# EAGLE schematic EEZ DIB DCP505 r1B2 (EAGLE 7.2.0)
Assembly variants: Farnell, TME

## Sheet 1 of 6
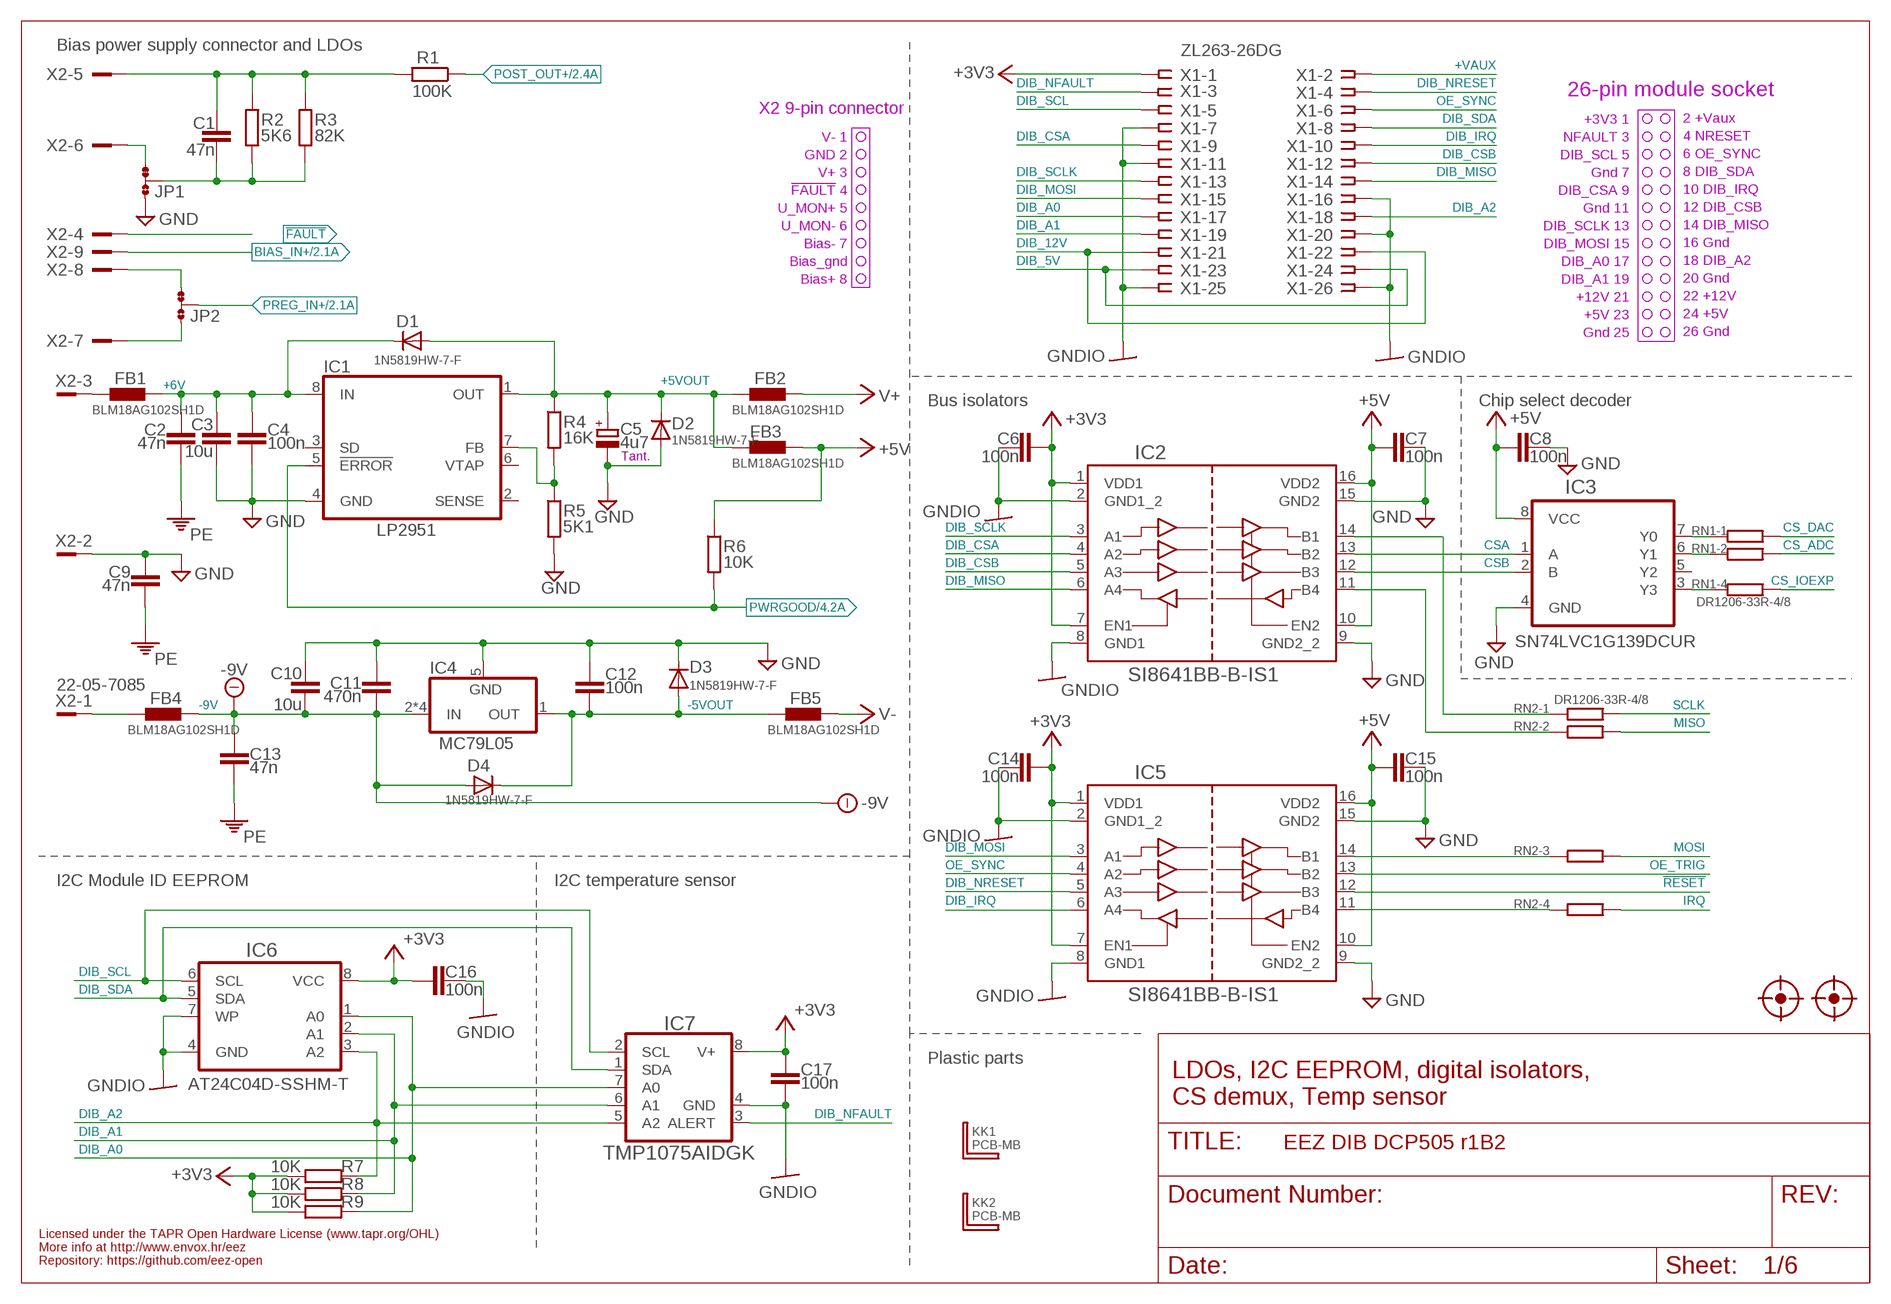
[diagram p0: schematic, sheet 1]

### Parts
C1  47n  C-EUC0805  [C0805]
C2  47n  C-EUC1206  [C1206]
C3  10u  C-EUC1206  [C1206]
C4  100n  C-EUC0603  [C0603]
C5  4u7  ECAP1206  [EC1206]
C6  100n  C-EUC0603  [C0603]
C7  100n  C-EUC0603  [C0603]
C8  100n  C-EUC0603  [C0603]
C9  47n  C-EUC1206  [C1206]
C10  10u  C-EUC1206  [C1206]
C11  470n  C-EUC0805  [C0805]
C12  100n  C-EUC0603  [C0603]
C13  47n  C-EUC1206  [C1206]
C14  100n  C-EUC0603  [C0603]
C15  100n  C-EUC0603  [C0603]
C16  100n  C-EUC0603  [C0603]
C17  100n  C-EUC0603  [C0603]
D1  1N5819HW-7-F  DIODE-SOD323-W  [SOD323-W]
D2  1N5819HW-7-F  DIODE-SOD323-W  [SOD323-W]
D3  1N5819HW-7-F  DIODE-SOD323-W  [SOD323-W]
D4  1N5819HW-7-F  DIODE-SOD323-W  [SOD323-W]
FB1  BLM18AG102SH1D  FERRITE_BEAD0603  [BEAD0603]
FB2  BLM18AG102SH1D  FERRITE_BEAD0603  [BEAD0603]
FB3  BLM18AG102SH1D  FERRITE_BEAD0603  [BEAD0603]
FB4  BLM18AG102SH1D  FERRITE_BEAD0603  [BEAD0603]
FB5  BLM18AG102SH1D  FERRITE_BEAD0603  [BEAD0603]
FM1  FIDUCIAL_2  [FIDUCIAL_DUAL]
FM2  FIDUCIAL_2  [FIDUCIAL_DUAL]
IC1  LP2951  LP2951SO8  [SOIC127P600X175-8N]
IC2  SI8641BB-B-IS1  SI8641NSOIC-16  [SOIC-16]
IC3  SN74LVC1G139DCUR  SN74LVC1G139-VSSOP  [DCU8]
IC4  MC79L05  MC79LXXSOIC  [SOIC127P600X173-8N]
IC5  SI8641BB-B-IS1  SI8641NSOIC-16  [SOIC-16]
IC6  AT24C04D-SSHM-T  AT24CXXSOIC8  [SOIC127P600X173-8N]
IC7  TMP1075AIDGK  TMPX75DGK  [DGK8]
JP1  JP3-CUT  [JP3-CUT]
JP2  JP3-CUT  [JP3-CUT]
KK1  PCB-MB  [PCB-MB]
KK2  PCB-MB  [PCB-MB]
R1  100K  R-EU_R0805  [R0805]
R2  5K6  R-EU_R0805  [R0805]
R3  82K  R-EU_R0805  [R0805]
R4  16K  R-EU_R0805  [R0805]
R5  5K1  R-EU_R0805  [R0805]
R6  10K  R-EU_R0805  [R0805]
R7  10K  R-EU_R0805  [R0805]
R8  10K  R-EU_R0805  [R0805]
R9  10K  R-EU_R0805  [R0805]
RN1  DR1206-33R-4/8  R_ARRAY4  [CAY16]
RN2  DR1206-33R-4/8  R_ARRAY4  [CAY16]
X1  ZL263-26DG  SSW-113-02-T-D-RA  [SSW-113-02-T-D-RA]
X2  22-05-7085  SPOX_22-05-7095  [SPOX_22-05-7095]

### Nets
!FAULT: X2.4 ; also sheet 6
!RESET: IC5.12(B3) ; also sheet 4
+3V3: C6.1 C14.1 C16.2 C17.1 IC2.1(VDD1) IC2.7(EN1) IC5.1(VDD1) IC5.7(EN1) IC6.8(VCC) IC7.8(V+) R7.1 R8.1 R9.1 X1.1
+5V: C7.2 C8.1 C15.2 FB3.P$2 IC2.10(EN2) IC2.16(VDD2) IC3.8(VCC) IC5.10(EN2) IC5.16(VDD2) R6.1 ; also sheet 2,4,5,6
+5VOUT: C5.+ D1.A D2.C FB2.P$1 FB3.P$1 IC1.1(OUT) R4.1
+6V: C2.1 C3.1 C4.1 D1.C FB1.P$2 IC1.8(IN)
+VAUX: X1.2
-5VOUT: C12.2 D3.A D4.C FB5.P$1 IC4.1(OUT)
-9V: C10.2 C11.2 C13.1 D4.A FB4.P$2 IC4.2(IN) IC4.3(IN) IC4.6(IN) IC4.7(IN) ; also sheet 2
BIAS_IN+: X2.9 ; also sheet 2
CS_ADC: RN1.7 ; also sheet 4
CS_DAC: RN1.8 ; also sheet 4
CS_IOEXP: RN1.5 ; also sheet 4
CSA: IC2.13(B2) IC3.1(A)
CSB: IC2.12(B3) IC3.2(B)
DIB_5V: X1.23 X1.24
DIB_12V: X1.21 X1.22
DIB_A0: IC6.1(A0) IC7.7(A0) R9.2 X1.17
DIB_A1: IC6.2(A1) IC7.6(A1) R8.2 X1.19
DIB_A2: IC6.3(A2) IC7.5(A2) R7.2 X1.18
DIB_CSA: IC2.4(A2) X1.9
DIB_CSB: IC2.5(A3) X1.12
DIB_IRQ: IC5.6(A4) X1.10
DIB_MISO: IC2.6(A4) X1.14
DIB_MOSI: IC5.3(A1) X1.15
DIB_NFAULT: IC7.3(ALERT) X1.3
DIB_NRESET: IC5.5(A3) X1.4
DIB_SCL: IC6.6(SCL) IC7.2(SCL) X1.5
DIB_SCLK: IC2.3(A1) X1.13
DIB_SDA: IC6.5(SDA) IC7.1(SDA) X1.8
GND: C3.2 C4.2 C5.- C7.1 C8.2 C9.1 C10.1 C11.1 C12.1 C15.1 D2.A D3.C IC1.4(GND) IC2.9(GND2_2) IC2.15(GND2) IC3.4(GND) IC4.5(GND) IC5.9(GND2_2) IC5.15(GND2) JP1.NO R5.2 X2.2 ; also sheet 2,3,4,5,6
GNDIO: C6.2 C14.2 C16.1 C17.2 IC2.2(GND1_2) IC2.8(GND1) IC5.2(GND1_2) IC5.8(GND1) IC6.4(GND) IC6.7(WP) IC7.4(GND) X1.7 X1.11 X1.16 X1.20 X1.25 X1.26
IRQ: RN2.5 ; also sheet 4
MISO: RN2.7 ; also sheet 4
MOSI: RN2.6 ; also sheet 4
N$2: FB1.P$1 X2.3
N$5: FB4.P$1 X2.1
N$6: IC3.7(Y0) RN1.1
N$9: IC2.11(B4) RN2.2
N$10: IC5.11(B4) RN2.4
N$13: C1.2 JP1.COM R2.2 R3.2
N$16: C1.1 R1.2 R2.1 R3.1 X2.5
N$22: IC3.6(Y1) RN1.2
N$26: IC3.3(Y3) RN1.4
N$27: JP1.NC X2.6
N$61: IC5.14(B1) RN2.3
N$64: JP2.NO X2.7
N$66: JP2.NC X2.8
N$101: IC1.7(FB) R4.2 R5.1
N$122: IC2.14(B1) RN2.1
OE_SYNC: IC5.4(A2) X1.6
OE_TRIG: IC5.13(B2) ; also sheet 4
PE: C2.2 C9.2 C13.2 ; also sheet 2,6
POST_OUT+: R1.1 ; also sheet 2,6
PREG_IN+: JP2.COM ; also sheet 2
PWRGOOD: IC1.5(!ERROR) R6.2 ; also sheet 4,6
SCLK: RN2.8 ; also sheet 4
V+: FB2.P$2 ; also sheet 2,3,4,5
V-: FB5.P$2 ; also sheet 2,3,5
Unconnected: IC1.2(SENSE) IC1.3(SD) IC1.6(VTAP) IC3.5(Y2) RN1.3 RN1.6

### Notes on the sheet
- Bias power supply connector and LDOs
- 26-pin module socket
- X2 9-pin connector | +3V3 1
- 2 +Vaux
- V- 1 | NFAULT 3
- 4 NRESET
- GND 2 | DIB_SCL 5
- 6 OE_SYNC
- V+ 3 | Gnd 7
- 8 DIB_SDA
- !FAULT! 4 | DIB_CSA 9
- 10 DIB_IRQ
- U_MON+ 5 | Gnd 11
- 12 DIB_CSB
- U_MON- 6 | DIB_SCLK 13
- 14 DIB_MISO
- Bias- 7 | DIB_MOSI 15
- 16 Gnd
- Bias_gnd | DIB_A0 17
- 18 DIB_A2
- Bias+ 8 | DIB_A1 19
- 20 Gnd
- +12V 21
- 22 +12V
- +5V 23
- 24 +5V
- Gnd 25
- 26 Gnd
- Bus isolators | Chip select decoder
- Tant.
- I2C Module ID EEPROM | I2C temperature sensor
- Plastic parts
- LDOs, I2C EEPROM, digital isolators,
- CS demux, Temp sensor
- Licensed under the TAPR Open Hardware License (www.tapr.org/OHL)
- More info at http://www.envox.hr/eez
- Repository: https://github.com/eez-open

## Sheet 2 of 6
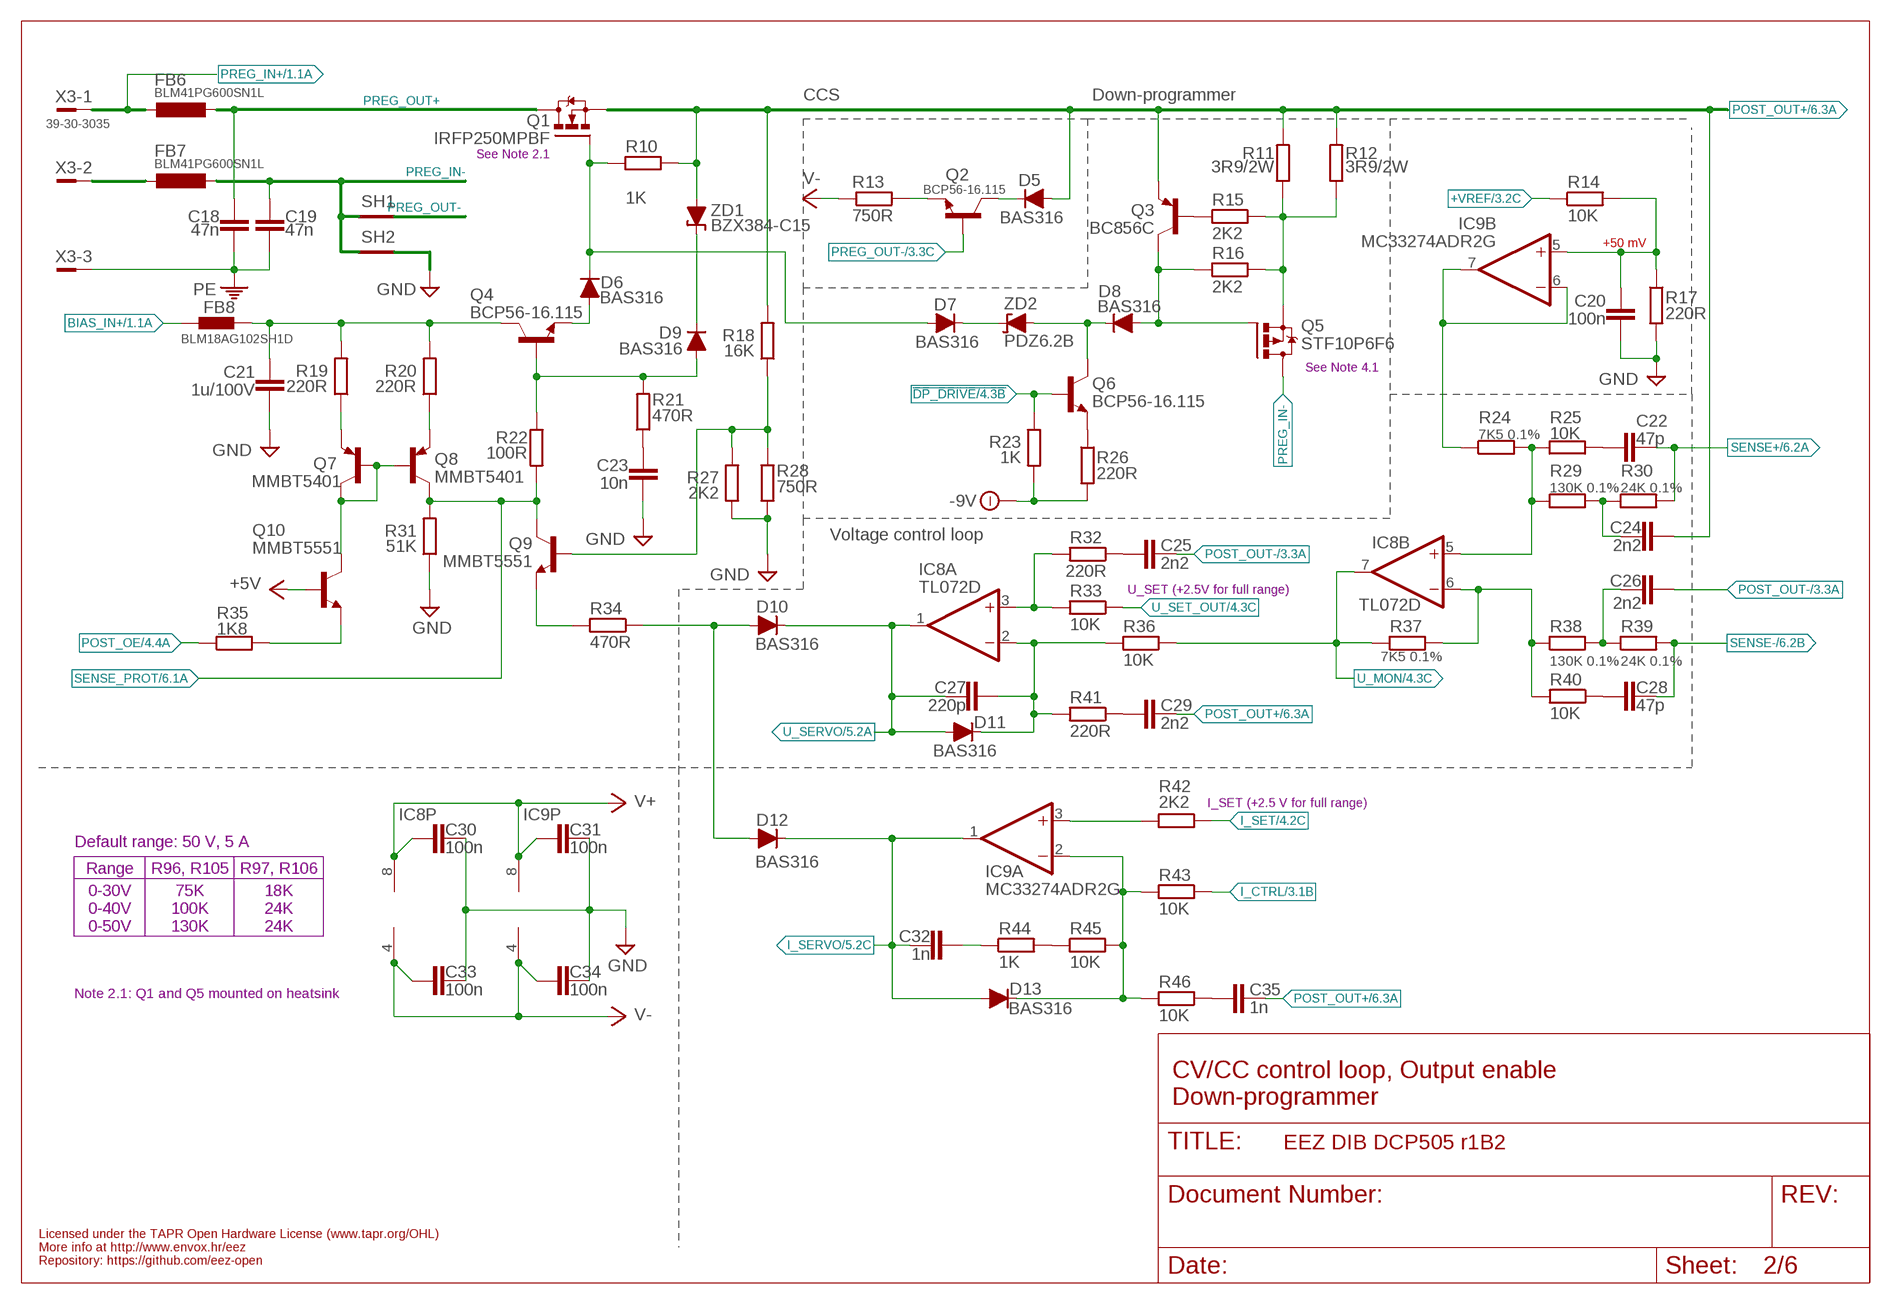
[diagram p1: schematic, sheet 2]

### Parts
C18  47n  C-EUC1206  [C1206]
C19  47n  C-EUC1206  [C1206]
C20  100n  C-EUC0603  [C0603]
C21  1u/100V  C-EUC1206  [C1206]
C22  47p  C-EUC0805  [C0805]
C23  10n  C-EUC0805  [C0805]
C24  2n2  C-EUC0805  [C0805]
C25  2n2  C-EUC0805  [C0805]
C26  2n2  C-EUC0805  [C0805]
C27  220p  C-EUC0805  [C0805]
C28  47p  C-EUC0805  [C0805]
C29  2n2  C-EUC0805  [C0805]
C30  100n  C-EUC0603  [C0603]
C31  100n  C-EUC0603  [C0603]
C32  1n  C-EUC0805  [C0805]
C33  100n  C-EUC0603  [C0603]
C34  100n  C-EUC0603  [C0603]
C35  1n  C-EUC0805  [C0805]
D5  BAS316  DIODESOD323R  [SOD323-R]
D6  BAS316  DIODESOD323R  [SOD323-R]
D7  BAS316  DIODESOD323R  [SOD323-R]
D8  BAS316  DIODESOD323R  [SOD323-R]
D9  BAS316  DIODESOD323R  [SOD323-R]
D10  BAS316  DIODESOD323R  [SOD323-R]
D11  BAS316  DIODESOD323R  [SOD323-R]
D12  BAS316  DIODESOD323R  [SOD323-R]
D13  BAS316  DIODESOD323R  [SOD323-R]
FB6  BLM41PG600SN1L  L-EUL1812  [L1812]
FB7  BLM41PG600SN1L  L-EUL1812  [L1812]
FB8  BLM18AG102SH1D  FERRITE_BEAD0603  [BEAD0603]
IC8  TL072D  TL072SOIC8  [SOIC127P600X173-8N]
IC9  MC33274ADR2G  TL072SOIC8  [SOIC127P600X173-8N]
Q1  IRFP250MPBF  IRFP240MIRROR2  [TO247BH-CLR2]
Q2  BCP56-16.115  BCP56  [SOT230P700X180-4N]
Q3  BC856C  BC857C-PNP-SOT23-BEC  [SOT23-BEC]
Q4  BCP56-16.115  BCP56  [SOT230P700X180-4N]
Q5  STF10P6F6  P-MOSFETMIRROR2  [TO220H-CLR2]
Q6  BCP56-16.115  BCP56  [SOT230P700X180-4N]
Q7  MMBT5401  BC857B-PNP-SOT23-BEC  [SOT23-BEC]
Q8  MMBT5401  BC857B-PNP-SOT23-BEC  [SOT23-BEC]
Q9  MMBT5551  MMBT5551LT1-NPN-SOT23-BEC  [SOT23-BEC]
Q10  MMBT5551  MMBT5551LT1-NPN-SOT23-BEC  [SOT23-BEC]
R10  1K  R-EU_R0805  [R0805]
R11  3R9/2W  R-EU_R2512  [R2512]
R12  3R9/2W  R-EU_R2512  [R2512]
R13  750R  R-EU_R0805  [R0805]
R14  10K  R-EU_R0805  [R0805]
R15  2K2  R-EU_R0805  [R0805]
R16  2K2  R-EU_R0805  [R0805]
R17  220R  R-EU_R0805  [R0805]
R18  16K  R-EU_R0805  [R0805]
R19  220R  R-EU_R0805  [R0805]
R20  220R  R-EU_R0805  [R0805]
R21  470R  R-EU_R0805  [R0805]
R22  100R  R-EU_R0805  [R0805]
R23  1K  R-EU_R0805  [R0805]
R24  7K5 0.1%  R-EU_R0805  [R0805]
R25  10K  R-EU_R0805  [R0805]
R26  220R  R-EU_R0805  [R0805]
R27  2K2  R-EU_R0805  [R0805]
R28  750R  R-EU_R0805  [R0805]
R29  130K 0.1%  R-EU_R0805  [R0805]
R30  24K 0.1%  R-EU_R0805  [R0805]
R31  51K  R-EU_R0805  [R0805]
R32  220R  R-EU_R0805  [R0805]
R33  10K  R-EU_R0805  [R0805]
R34  470R  R-EU_R0805  [R0805]
R35  1K8  R-EU_R0805  [R0805]
R36  10K  R-EU_R0805  [R0805]
R37  7K5 0.1%  R-EU_R0805  [R0805]
R38  130K 0.1%  R-EU_R0805  [R0805]
R39  24K 0.1%  R-EU_R0805  [R0805]
R40  10K  R-EU_R0805  [R0805]
R41  220R  R-EU_R0805  [R0805]
R42  2K2  R-EU_R0805  [R0805]
R43  10K  R-EU_R0805  [R0805]
R44  1K  R-EU_R0805  [R0805]
R45  10K  R-EU_R0805  [R0805]
R46  10K  R-EU_R0805  [R0805]
SH1  SHORTNOHOLE  [SHORT_NOHOLE]
SH2  SHORTNOHOLE  [SHORT_NOHOLE]
X3  39-30-3035  MINIFIT_6659-3  [MINIFIT_6659-3]
ZD1  BZX384-C15  ZENER-DIODESOD323  [SOD323-W]
ZD2  PDZ6.2B  ZENER-DIODESOD323  [SOD323-W]

### Nets
!DP_DRIVE: Q6.1(B) R23.1 ; also sheet 4
+5V: Q10.B ; also sheet 1,4,5,6
+VREF: R14.1 ; also sheet 3,4
-9V: R23.2 R26.2 ; also sheet 1
BIAS_IN+: FB8.P$1 ; also sheet 1
CCS_HS: D5.C Q2.2(C) Q2.4(C)
DC_BIAS: C21.1 FB8.P$2 Q4.2(C) Q4.4(C) R19.2 R20.2
DP_S: Q5.3(S) R11.1 R12.1 R15.1 R16.1
GCOM: IC9.6(B:-IN) IC9.7(B:OUT) R24.1
GND: C20.2 C21.2 C23.2 C30.1 C31.1 C33.1 C34.1 R17.2 R27.1 R28.1 R31.1 SH2.P$2(GND_B) ; also sheet 1,3,4,5,6
I_CTRL: R43.1 ; also sheet 3
I_SERVO: C32.2 D12.C D13.A IC9.1(A:OUT) ; also sheet 5
I_SET: R42.1 ; also sheet 4
LOOP_CTRL: D10.A D12.A R34.1
N$11: FB7.1 X3.2
N$82: IC9.3(A:+IN) R42.2
N$83: IC8.3(A:+IN) R32.2 R33.2
N$84: C27.1 D11.C IC8.2(A:-IN) R36.2 R41.2
N$85: C26.1 R38.2 R39.1
N$86: C22.2 R25.1
N$87: C28.2 R40.1
N$88: C35.2 R46.1
N$89: D13.C IC9.2(A:-IN) R43.2 R45.2 R46.2
N$90: C25.2 R32.1
N$91: C29.2 R41.1
N$92: D6.C D7.A Q1.1(G) R10.1
N$93: D6.A Q4.3(E)
N$95: D9.A Q4.1(B) R21.2 R22.1
N$96: C23.1 R21.1
N$97: Q9.B R18.1 R27.2 R28.2
N$98: Q6.3(E) R26.1
N$99: Q3.B R15.2
N$102: C20.1 IC9.5(B:+IN) R14.2 R17.1
N$117: C24.1 R29.2 R30.1
N$129: D9.C ZD1.C
N$143: D7.C ZD2.C
N$145: Q9.E R34.2
N$147: D8.A Q3.C Q5.1(G) R16.2
N$150: IC8.5(B:+IN) R24.2 R25.2 R29.1
N$158: IC8.6(B:-IN) R37.2 R38.1 R40.2
N$160: R44.2 R45.1
N$162: C32.1 R44.1
N$166: Q2.3(E) R13.2
N$183: Q8.E R20.1
N$184: Q7.E R19.1
N$186: Q10.E R35.2
PE: C18.2 C19.2 X3.3 ; also sheet 1,6
POST_OE: R35.1 ; also sheet 4
POST_OUT+: C24.2 C29.1 C35.1 D5.A Q1.3(S) Q3.E R10.2 R11.2 R12.2 R18.2 ZD1.A ; also sheet 1,6
POST_OUT-: C25.1 C26.2 ; also sheet 3,6
PREG_IN+: FB6.1 X3.1 ; also sheet 1
PREG_IN-: C19.1 FB7.2 Q5.2(D) SH1.P$1(GND_A) SH2.P$1(GND_A)
PREG_OUT+: C18.1 FB6.2 Q1.2(D)
PREG_OUT-: Q2.1(B) SH1.P$2(GND_B) ; also sheet 3,5
Q6C: D8.C Q6.2(C) Q6.4(C) ZD2.A
Q7C: Q7.B Q7.C Q8.B Q10.C
SENSE+: C22.1 R30.2 ; also sheet 6
SENSE-: C28.1 R39.2 ; also sheet 6
SENSE_PROT: Q8.C Q9.C R22.2 R31.2 ; also sheet 6
U_MON: IC8.7(B:OUT) R36.1 R37.1 ; also sheet 4,5
U_SERVO: C27.2 D10.C D11.A IC8.1(A:OUT) ; also sheet 5
U_SET_OUT: R33.1 ; also sheet 4
V+: C30.2 C31.2 IC8.8(P:V+) IC9.8(P:V+) ; also sheet 1,3,4,5
V-: C33.2 C34.2 IC8.4(P:V-) IC9.4(P:V-) R13.1 ; also sheet 1,3,5

### Notes on the sheet
- CCS | Down-programmer
- See Note 2.1
- +50 mV
- See Note 4.1
- Voltage control loop
- U_SET (+2.5V for full range)
- I_SET (+2.5 V for full range)
- Default range: 50 V, 5 A
- Range | R96, R105 | R97, R106
- 0-30V | 75K | 18K
- 0-40V | 100K | 24K
- 0-50V | 130K | 24K
- Note 2.1: Q1 and Q5 mounted on heatsink
- CV/CC control loop, Output enable
- Down-programmer
- Licensed under the TAPR Open Hardware License (www.tapr.org/OHL)
- More info at http://www.envox.hr/eez
- Repository: https://github.com/eez-open

## Sheet 3 of 6
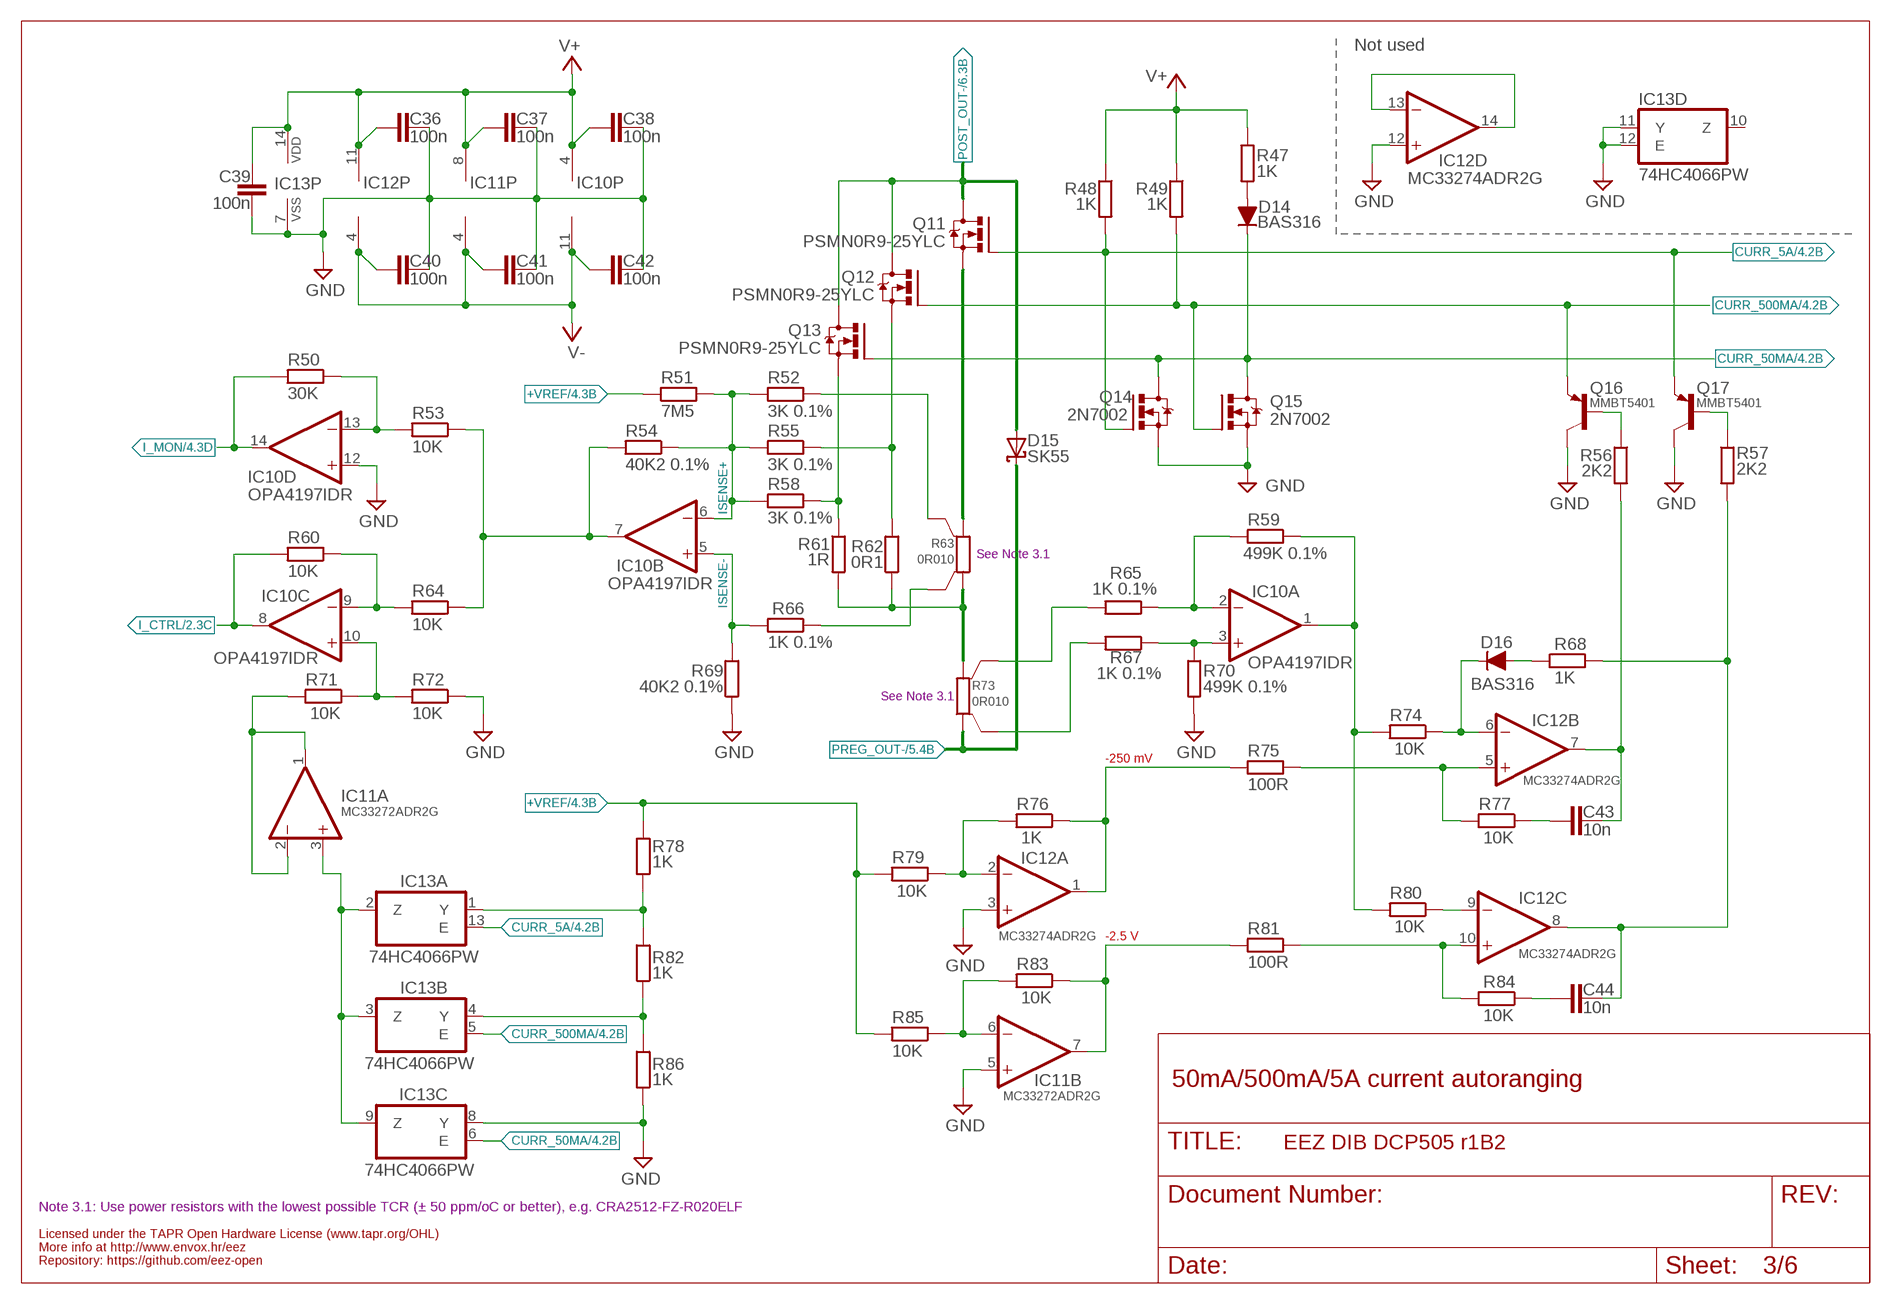
[diagram p2: schematic, sheet 3]

### Parts
C36  100n  C-EUC0603  [C0603]
C37  100n  C-EUC0603  [C0603]
C38  100n  C-EUC0603  [C0603]
C39  100n  C-EUC0603  [C0603]
C40  100n  C-EUC0603  [C0603]
C41  100n  C-EUC0603  [C0603]
C42  100n  C-EUC0603  [C0603]
C43  10n  C-EUC0603  [C0603]
C44  10n  C-EUC0603  [C0603]
D14  BAS316  DIODESOD323R  [SOD323-R]
D15  SK55  SCHOTTKYSMB  [SMB]
D16  BAS316  DIODESOD323R  [SOD323-R]
IC10  OPA4197IDR  TL074SOIC14  [SOIC127P600X175-14N]
IC11  MC33272ADR2G  TL072SOIC8  [SOIC127P600X173-8N]
IC12  MC33274ADR2G  TL074SOIC14  [SOIC127P600X175-14N]
IC13  74HC4066PW  [SOP65P640X120-14N]
Q11  PSMN0R9-25YLC  N-MOSFETLFPAK  [SOT669]
Q12  PSMN0R9-25YLC  N-MOSFETLFPAK  [SOT669]
Q13  PSMN0R9-25YLC  N-MOSFETLFPAK  [SOT669]
Q14  2N7002  [SOT103P240X110-3N]
Q15  2N7002  [SOT103P240X110-3N]
Q16  MMBT5401  BC857B-PNP-SOT23-BEC  [SOT23-BEC]
Q17  MMBT5401  BC857B-PNP-SOT23-BEC  [SOT23-BEC]
R47  1K  R-EU_R0805  [R0805]
R48  1K  R-EU_R0805  [R0805]
R49  1K  R-EU_R0805  [R0805]
R50  30K  R-EU_R0805  [R0805]
R51  7M5  R-EU_R0805  [R0805]
R52  3K 0.1%  R-EU_R0603  [R0603]
R53  10K  R-EU_R0805  [R0805]
R54  40K2 0.1%  R-EU_R0603  [R0603]
R55  3K 0.1%  R-EU_R0603  [R0603]
R56  2K2  R-EU_R0805  [R0805]
R57  2K2  R-EU_R0805  [R0805]
R58  3K 0.1%  R-EU_R0603  [R0603]
R59  499K 0.1%  R-EU_R0603  [R0603]
R60  10K  R-EU_R0805  [R0805]
R61  1R  R-EU_R0805  [R0805]
R62  0R1  R-EU_R1206  [R1206]
R63  0R010  R-EU_4WIREH2728  [R_H2728]
R64  10K  R-EU_R0805  [R0805]
R65  1K 0.1%  R-EU_R0603  [R0603]
R66  1K 0.1%  R-EU_R0603  [R0603]
R67  1K 0.1%  R-EU_R0603  [R0603]
R68  1K  R-EU_R0805  [R0805]
R69  40K2 0.1%  R-EU_R0603  [R0603]
R70  499K 0.1%  R-EU_R0603  [R0603]
R71  10K  R-EU_R0805  [R0805]
R72  10K  R-EU_R0805  [R0805]
R73  0R010  R-EU_4WIREH2728  [R_H2728]
R74  10K  R-EU_R0805  [R0805]
R75  100R  R-EU_R0805  [R0805]
R76  1K  R-EU_R0805  [R0805]
R77  10K  R-EU_R0805  [R0805]
R78  1K  R-EU_R0805  [R0805]
R79  10K  R-EU_R0805  [R0805]
R80  10K  R-EU_R0805  [R0805]
R81  100R  R-EU_R0805  [R0805]
R82  1K  R-EU_R0805  [R0805]
R83  10K  R-EU_R0805  [R0805]
R84  10K  R-EU_R0805  [R0805]
R85  10K  R-EU_R0805  [R0805]
R86  1K  R-EU_R0805  [R0805]

### Nets
+VREF: R51.1 R78.2 R79.2 R85.2 ; also sheet 2,4
CURR_5A: IC13.13(A:E) Q11.4(G) Q14.1(G) Q17.E R48.2 ; also sheet 4
CURR_50MA: D14.C IC13.6(C:E) Q13.4(G) Q14.3(D) Q15.3(D) ; also sheet 4
CURR_500MA: IC13.5(B:E) Q12.4(G) Q15.1(G) Q16.E R49.2 ; also sheet 4
GND: C36.2 C37.2 C38.2 C39.1 C40.2 C41.2 C42.2 IC10.12(D:+IN) IC11.5(B:+IN) IC12.3(A:+IN) IC12.12(D:+IN) IC13.7(P:VSS) IC13.8(C:Y) IC13.11(D:Y) IC13.12(D:E) Q14.2(S) Q15.2(S) Q16.C Q17.C R69.1 R70.2 R72.1 R86.1 ; also sheet 1,2,4,5,6
I_CTRL: IC10.8(C:OUT) R60.2 ; also sheet 2
I_MON: IC10.14(D:OUT) R50.2 ; also sheet 4
ISENSE+: IC10.6(B:-IN) R51.2 R52.2 R54.1 R55.2 R58.2
ISENSE-: IC10.5(B:+IN) R66.2 R69.2
N$1: R65.2 R73.2S
N$7: R61.2 R62.1 R63.1 R73.2
N$8: IC11.1(A:OUT) IC11.2(A:-IN) R71.2
N$23: IC11.6(B:-IN) R83.2 R85.1
N$28: IC10.2(A:-IN) R59.2 R65.1
N$29: Q11.1(S) Q11.2(S) Q11.3(S) R63.2
N$34: D14.A R47.2
N$35: IC10.1(A:OUT) R59.1 R74.2 R80.2
N$36: IC11.3(A:+IN) IC13.2(A:Z) IC13.3(B:Z) IC13.9(C:Z)
N$37: C43.2 IC12.7(B:OUT) R56.2
N$38: Q16.B R56.1
N$39: Q17.B R57.1
N$40: IC10.7(B:OUT) R53.1 R54.2 R64.1
N$41: IC10.9(C:-IN) R60.1 R64.2
N$42: IC13.1(A:Y) R78.1 R82.2
N$43: C44.2 IC12.8(C:OUT) R57.2 R68.2
N$44: IC10.10(C:+IN) R71.1 R72.2
N$47: IC13.4(B:Y) R82.1 R86.2
N$48: IC11.7(B:OUT) R81.2 R83.1
N$49: IC10.13(D:-IN) R50.1 R53.2
N$50: R67.2 R73.1S
N$51: R63.1S R66.1
N$52: IC12.2(A:-IN) R76.2 R79.1
N$53: IC12.1(A:OUT) R75.2 R76.1
N$54: IC10.3(A:+IN) R67.1 R70.1
N$55: IC12.13(D:-IN) IC12.14(D:OUT)
N$56: Q12.1(S) Q12.2(S) Q12.3(S) R55.1 R62.2
N$57: D16.C IC12.6(B:-IN) R74.1
N$58: IC12.5(B:+IN) R75.1 R77.2
N$59: R52.1 R63.2S
N$60: IC12.9(C:-IN) R80.1
N$62: IC12.10(C:+IN) R81.1 R84.2
N$63: Q13.1(S) Q13.2(S) Q13.3(S) R58.1 R61.1
N$65: C43.1 R77.1
N$67: C44.1 R84.1
N$74: D16.A R68.1
POST_OUT-: D15.A Q11.MB(D) Q12.MB(D) Q13.MB(D) ; also sheet 2,6
PREG_OUT-: D15.C R73.1 ; also sheet 2,5
V+: C36.1 C37.1 C38.1 C39.2 IC10.4(P:V+) IC11.8(P:V+) IC12.11(P:V-) IC13.14(P:VDD) R47.1 R48.1 R49.1 ; also sheet 1,2,4,5
V-: C40.1 C41.1 C42.1 IC10.11(P:V-) IC11.4(P:V-) IC12.4(P:V+) ; also sheet 1,2,5
Unconnected: IC13.10(D:Z)

### Notes on the sheet
- Not used
- See Note 3.1
- See Note 3.1
- -250 mV
- -2.5 V
- 50mA/500mA/5A current autoranging
- Note 3.1: Use power resistors with the lowest possible TCR (± 50 ppm/oC or better), e.g. CRA2512-FZ-R020ELF
- Licensed under the TAPR Open Hardware License (www.tapr.org/OHL)
- More info at http://www.envox.hr/eez
- Repository: https://github.com/eez-open

## Sheet 4 of 6
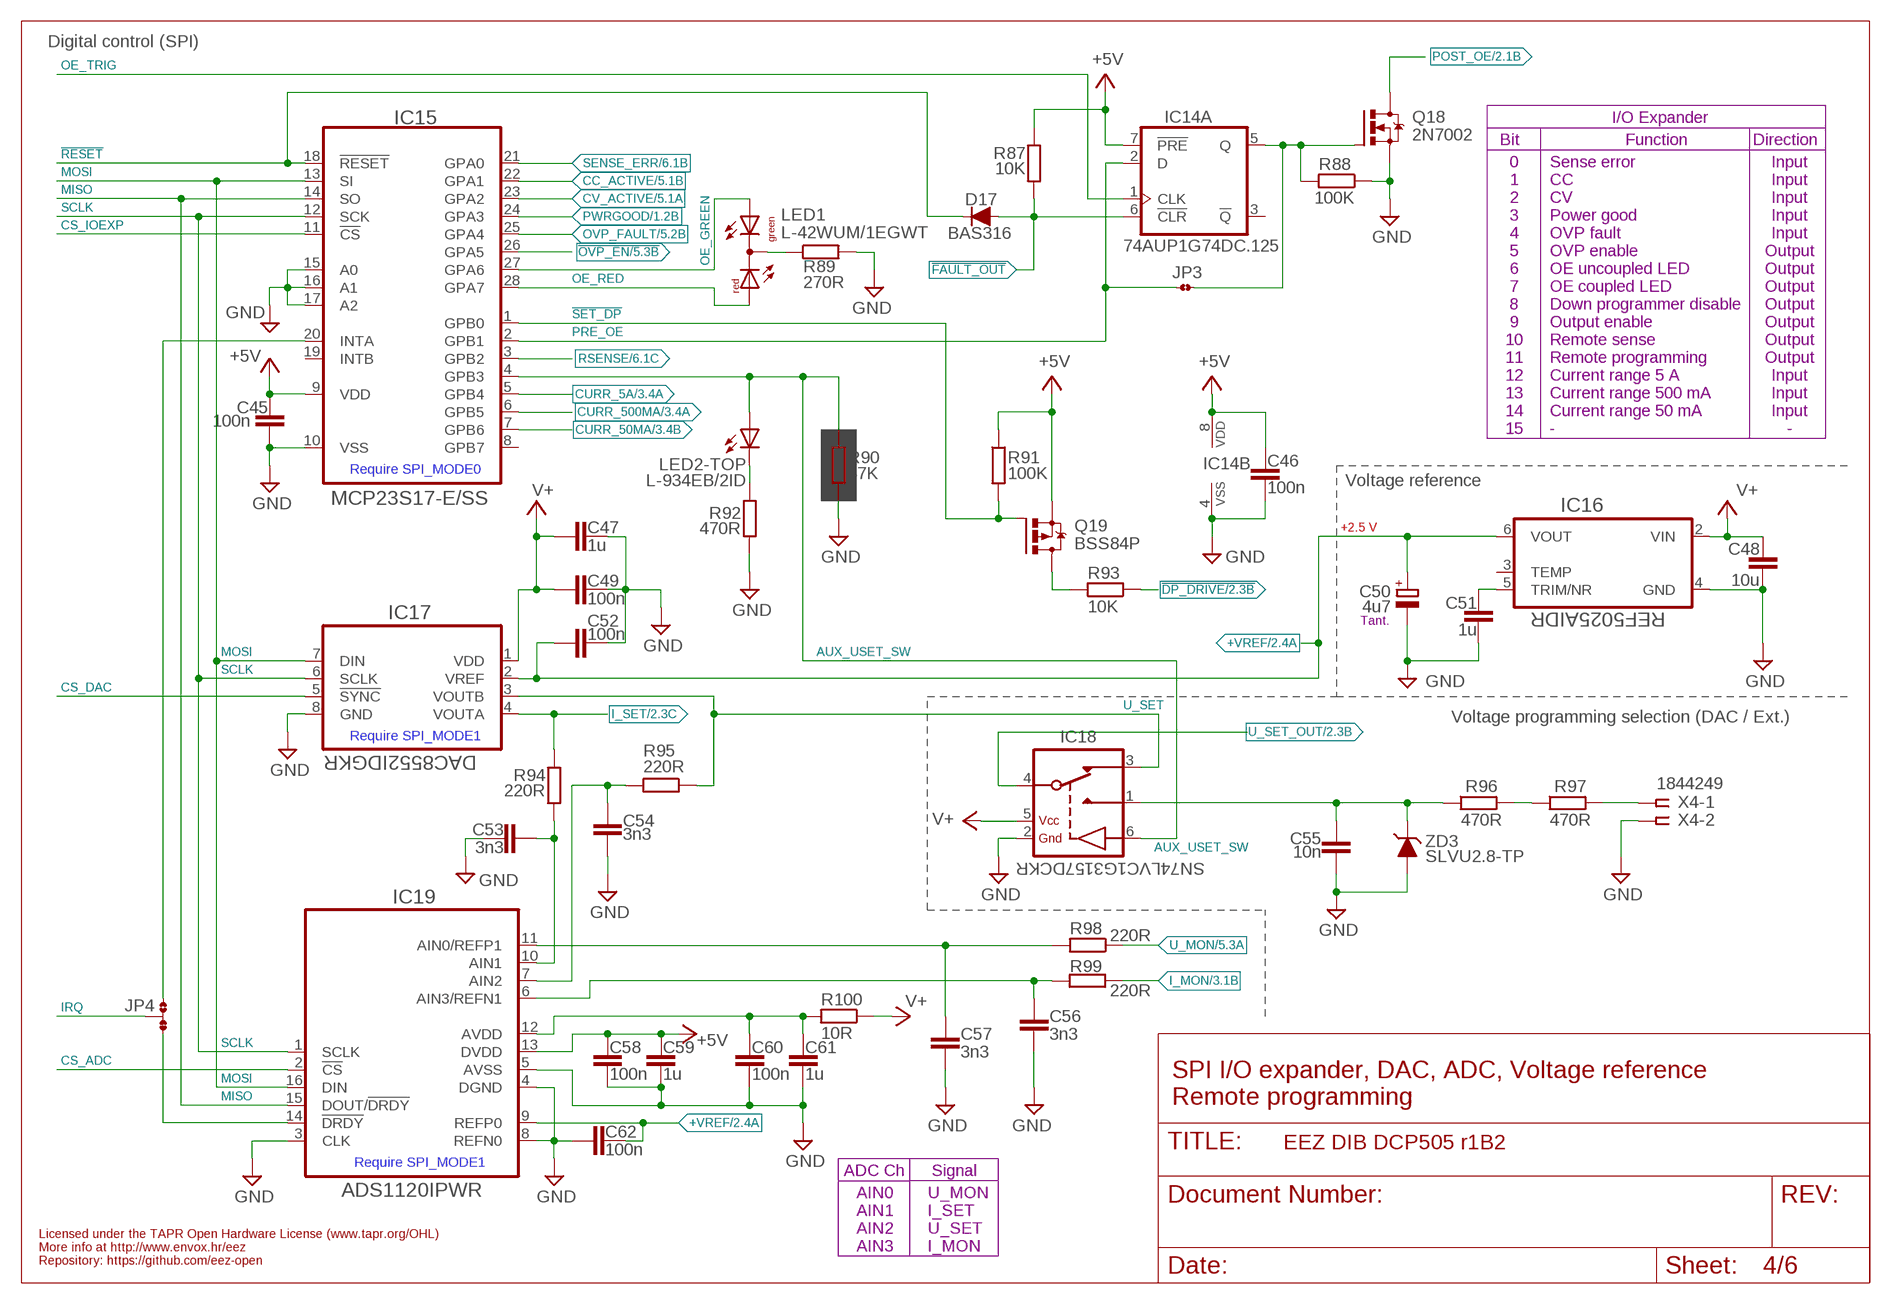
[diagram p3: schematic, sheet 4]

### Parts
C45  100n  C-EUC0603  [C0603]
C46  100n  C-EUC0603  [C0603]
C47  1u  C-EUC0805  [C0805]
C48  10u  C-EUC1206  [C1206]
C49  100n  C-EUC0603  [C0603]
C50  4u7  ECAP1206  [EC1206]
C51  1u  C-EUC0805  [C0805]
C52  100n  C-EUC0603  [C0603]
C53  3n3  C-EUC0805  [C0805]
C54  3n3  C-EUC0805  [C0805]
C55  10n  C-EUC0805  [C0805]
C56  3n3  C-EUC0805  [C0805]
C57  3n3  C-EUC0805  [C0805]
C58  100n  C-EUC0603  [C0603]
C59  1u  C-EUC0805  [C0805]
C60  100n  C-EUC0603  [C0603]
C61  1u  C-EUC0805  [C0805]
C62  100n  C-EUC0603  [C0603]
D17  BAS316  DIODESOD323R  [SOD323-R]
IC14  74AUP1G74DC.125  SN74LVC1G74DCTR-VSSOP  [DCU8]
IC15  MCP23S17-E/SS  MCP23S17-E/SSSSOP  [SOP65P780X200-28N]
IC16  REF5025AIDR  REF50XX  [SOIC127P600X175-8N]
IC17  DAC8552IDGKR  DAC8552_DGK_8M  [DGK8-M]
IC18  SN74LVC1G3157DCKR  SN74LVC1G3157-DCK  [SOT65P210X110-6N]
IC19  ADS1120IPWR  ADS1120TSSOP-16  [PW(R-PDSO-G16)]
JP3  JP2-CUT  [JP2-CUT]
JP4  JP3-CUT  [JP3-CUT]
LED1  L-42WUM/1EGWT  LED_L-42WUM/1EGWT  [L-42WUM-1EGWT]
LED2  L-934EB/2ID  LED_L-934EB/2ID  [L-934EB]
Q18  2N7002  [SOT103P240X110-3N]
Q19  BSS84P  IRLML2246TRPBF  [SOT95P237X112-3N]
R87  10K  R-EU_R0805  [R0805]
R88  100K  R-EU_R0805  [R0805]
R89  270R  R-EU_R0805  [R0805]
R90  47K  R-EU_R0805  [R0805]
R91  100K  R-EU_R0805  [R0805]
R92  470R  R-EU_R0805  [R0805]
R93  10K  R-EU_R0805  [R0805]
R94  220R  R-EU_R0805  [R0805]
R95  220R  R-EU_R0805  [R0805]
R96  470R  R-EU_R0805  [R0805]
R97  470R  R-EU_R0805  [R0805]
R98  220R  R-EU_R0805  [R0805]
R99  220R  R-EU_R0805  [R0805]
R100  10R  R-EU_R0805  [R0805]
X4  1844249  MC1,5/5-G-3,5  [MC1,5/5-G-3,5]
ZD3  SLVU2.8-TP  SLVU2.8  [SOT23]

### Nets
!DP_DRIVE: R93.1 ; also sheet 2
!DRDY: IC19.14(!DRDY) JP4.NC
!FAULT_OUT: D17.A IC14.6(A:!CLR) R87.2 ; also sheet 6
!OVP_EN: IC15.26(GPA5) ; also sheet 5
!RESET: D17.C IC15.18(!RESET) ; also sheet 1
!SET_DP: IC15.1(GPB0) Q19.1(G) R91.2
+5V: C45.1 C46.2 C58.2 C59.2 IC14.7(A:!PRE) IC14.8(B:VDD) IC15.9(VDD) IC19.13(DVDD) Q19.2(S) R87.1 R91.1 ; also sheet 1,2,5,6
+VREF: C50.+ C52.2 C62.2 IC16.6(VOUT) IC17.2(VREF) IC19.9(REFP0) ; also sheet 2,3
AUX_IN: C55.2 IC18.1(NO) R96.1 ZD3.3(C)
AUX_USET_SW: IC15.4(GPB3) IC18.6(CTRL) LED2.TA(-TOP:A) R90.2
CC_ACTIVE: IC15.22(GPA1) ; also sheet 5
CS_ADC: IC19.2(!CS) ; also sheet 1
CS_DAC: IC17.5(!SYNC) ; also sheet 1
CS_IOEXP: IC15.11(!CS) ; also sheet 1
CURR_5A: IC15.5(GPB4) ; also sheet 3
CURR_50MA: IC15.7(GPB6) ; also sheet 3
CURR_500MA: IC15.6(GPB5) ; also sheet 3
CV_ACTIVE: IC15.23(GPA2) ; also sheet 5
DP_LED: Q19.3(D) R93.2
GND: C45.2 C46.1 C47.2 C48.2 C49.1 C50.- C51.2 C52.1 C53.1 C54.1 C55.1 C56.2 C57.1 C58.1 C59.1 C60.1 C61.1 C62.1 IC14.4(B:VSS) IC15.10(VSS) IC15.15(A0) IC15.16(A1) IC15.17(A2) IC16.4(GND) IC17.8(GND) IC18.2(GND) IC19.3(CLK) IC19.4(DGND) IC19.5(AVSS) IC19.8(REFN0) Q18.2(S) R88.1 R89.2 R90.1 R92.1 X4.2 ZD3.1(A) ZD3.2(A) ; also sheet 1,2,3,5,6
I_MON: R99.1 ; also sheet 3
I_SET: IC17.4(VOUTA) R94.1 ; also sheet 2
IRQ: JP4.COM ; also sheet 1
MISO: IC15.14(SO) IC19.15(DOUT/!DRDY) ; also sheet 1
MOSI: IC15.13(SI) IC17.7(DIN) IC19.16(DIN) ; also sheet 1
N$3: IC15.20(INTA) JP4.NO
N$12: LED1.CC(C) R89.1
N$17: R96.2 R97.1
N$32: R97.2 X4.1
N$45: IC14.5(A:Q) JP3.2 Q18.1(G) R88.2
N$70: C60.2 C61.2 IC19.12(AVDD) R100.2
N$71: C51.1 IC16.5(TRIM/NR)
N$72: C53.2 IC19.10(AIN1) R94.2
N$73: C57.2 IC19.11(AIN0/REFP1) R98.2
N$80: C54.2 IC19.7(AIN2) R95.2
N$81: C56.1 IC19.6(AIN3/REFN1) R99.2
N$121: LED2.TC(-TOP:C) R92.2
OE_GREEN: IC15.27(GPA6) LED1.GREEN(AG)
OE_RED: IC15.28(GPA7) LED1.RED(AR)
OE_TRIG: IC14.1(A:CLK) ; also sheet 1
OVP_FAULT: IC15.25(GPA4) ; also sheet 5
POST_OE: Q18.3(D) ; also sheet 2
PRE_OE: IC14.2(A:D) IC15.2(GPB1) JP3.1
PWRGOOD: IC15.24(GPA3) ; also sheet 1,6
RSENSE: IC15.3(GPB2) ; also sheet 6
SCLK: IC15.12(SCK) IC17.6(SCLK) IC19.1(SCLK) ; also sheet 1
SENSE_ERR: IC15.21(GPA0) ; also sheet 6
U_MON: R98.1 ; also sheet 2,5
U_SET: IC17.3(VOUTB) IC18.3(NC) R95.1 ; also sheet 5
U_SET_OUT: IC18.4(COM) ; also sheet 2
V+: C47.1 C48.1 C49.2 IC16.2(VIN) IC17.1(VDD) IC18.5(VDD) R100.1 ; also sheet 1,2,3,5
Unconnected: IC14.3(A:!Q) IC15.8(GPB7) IC15.19(INTB) IC16.3(TEMP)

### Notes on the sheet
- Digital control (SPI)
- I/O Expander
- Bit | Function | Direction
- 0 | Sense error | Input
- 1 | CC | Input
- 2 | CV | Input
- 3 | Power good | Input
- 4 | OVP fault | Input
- 5 | OVP enable | Output
- 6 | OE uncoupled LED | Output
- 7 | OE coupled LED | Output
- 8 | Down programmer disable | Output
- 9 | Output enable | Output
- 10 | Remote sense | Output
- 11 | Remote programming | Output
- 12 | Current range 5 A | Input
- 13 | Current range 500 mA | Input
- 14 | Current range 50 mA | Input
- 15 | - | -
- Require SPI_MODE0 | Voltage reference
- +2.5 V
- Tant.
- Voltage programming selection (DAC / Ext.)
- Require SPI_MODE1
- SPI I/O expander, DAC, ADC, Voltage reference
- Remote programming
- Require SPI_MODE1
- ADC Ch | Signal
- AIN0 | U_MON
- AIN1 | I_SET
- AIN2 | U_SET
- Licensed under the TAPR Open Hardware License (www.tapr.org/OHL)
- More info at http://www.envox.hr/eez | AIN3 | I_MON
- Repository: https://github.com/eez-open

## Sheet 5 of 6
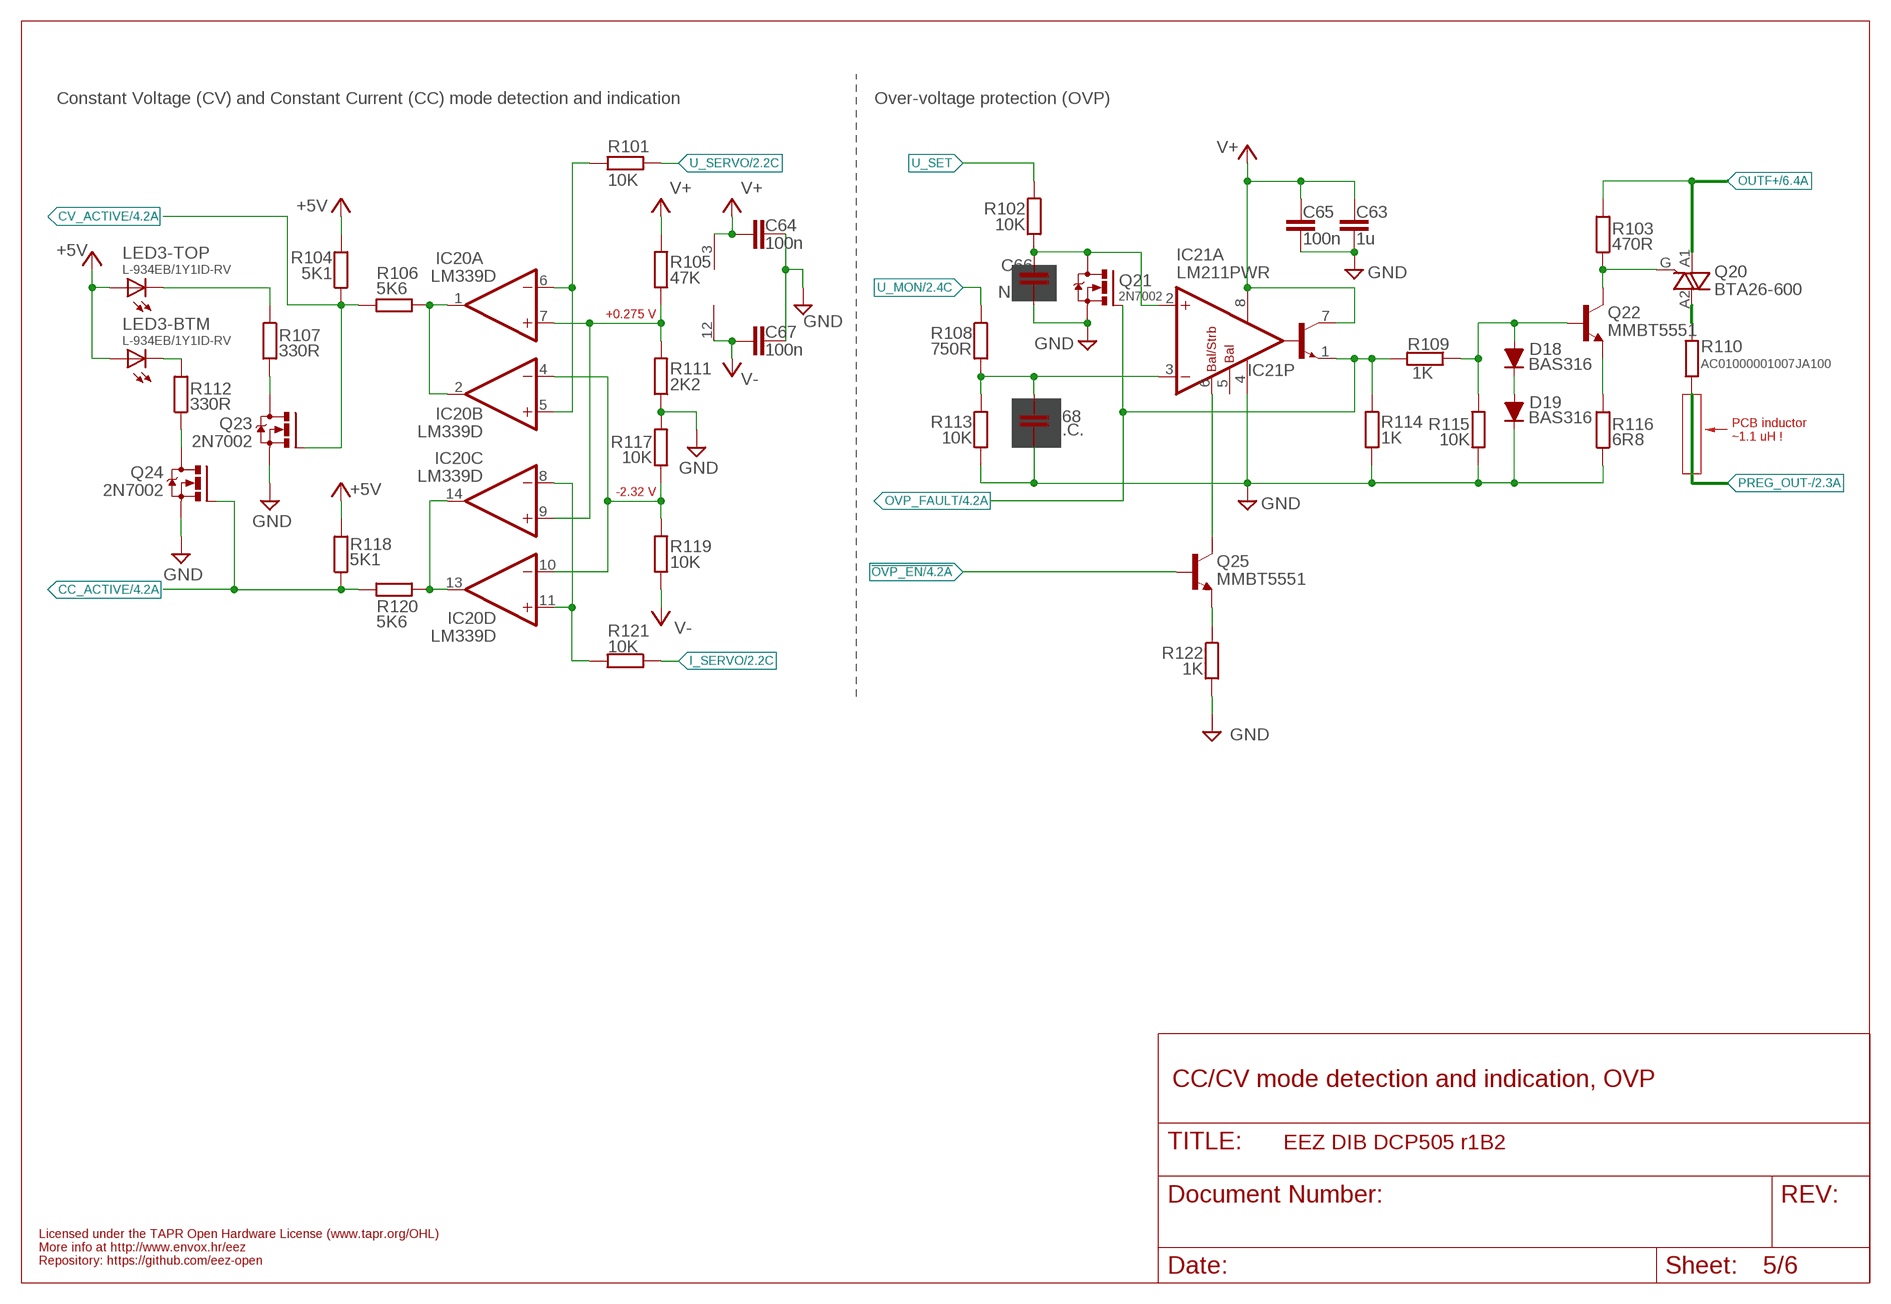
[diagram p4: schematic, sheet 5]

### Parts
C63  1u  C-EUC0805  [C0805]
C64  100n  C-EUC0603  [C0603]
C65  100n  C-EUC0603  [C0603]
C66  N.C.  C-EUC0805  [C0805]
C67  100n  C-EUC0603  [C0603]
C68  N.C.  C-EUC0805  [C0805]
D18  BAS316  DIODESOD323R  [SOD323-R]
D19  BAS316  DIODESOD323R  [SOD323-R]
IC20  LM339D  LM339SO14  [SOIC127P600X175-14N]
IC21  LM211PWR  LM211  [PW8_TSSOP8]
LED3  L-934EB/1Y1ID-RV  LED_L-934EB/1Y1ID-RV  [L-934EB]
Q20  BTA26-600  BTA41-2  [TOP3_TRIAC_NOHOLE]
Q21  2N7002  [SOT103P240X110-3N]
Q22  MMBT5551  MMBT5551LT1-NPN-SOT23-BEC  [SOT23-BEC]
Q23  2N7002  [SOT103P240X110-3N]
Q24  2N7002  [SOT103P240X110-3N]
Q25  MMBT5551  MMBT5551LT1-NPN-SOT23-BEC  [SOT23-BEC]
R101  10K  R-EU_R0805  [R0805]
R102  10K  R-EU_R0805  [R0805]
R103  470R  R-EU_R0805  [R0805]
R104  5K1  R-EU_R0805  [R0805]
R105  47K  R-EU_R0805  [R0805]
R106  5K6  R-EU_R0805  [R0805]
R107  330R  R-EU_R0805  [R0805]
R108  750R  R-EU_R0805  [R0805]
R109  1K  R-EU_R0805  [R0805]
R110  AC01000001007JA100  R-EU_0411/15  [0411/15]
R111  2K2  R-EU_R0805  [R0805]
R112  330R  R-EU_R0805  [R0805]
R113  10K  R-EU_R0805  [R0805]
R114  1K  R-EU_R0805  [R0805]
R115  10K  R-EU_R0805  [R0805]
R116  6R8  R-EU_R0805  [R0805]
R117  10K  R-EU_R0805  [R0805]
R118  5K1  R-EU_R0805  [R0805]
R119  10K  R-EU_R0805  [R0805]
R120  5K6  R-EU_R0805  [R0805]
R121  10K  R-EU_R0805  [R0805]
R122  1K  R-EU_R0805  [R0805]

### Nets
!OVP_EN: Q25.B ; also sheet 4
+5V: LED3.BA(-BTM:A) LED3.TA(-TOP:A) R104.2 R118.2 ; also sheet 1,2,4,6
CC_ACTIVE: Q24.1(G) R118.1 R120.2 ; also sheet 4
CC_LED: LED3.BC(-BTM:C) R112.2
CV_ACTIVE: Q23.1(G) R104.1 R106.2 ; also sheet 4
CV_LED: LED3.TC(-TOP:C) R107.1
GND: C63.2 C64.1 C65.1 C66.1 C67.1 C68.1 D19.C IC21.4(P:V-) Q21.2(S) Q23.2(S) Q24.2(S) R111.1 R113.2 R114.2 R115.1 R116.1 R117.2 R122.2 ; also sheet 1,2,3,4,6
I_SERVO: R121.1 ; also sheet 2
N$15: Q20.A2 R110.2
N$18: Q20.G Q22.C R103.1
N$19: Q22.E R116.2
N$20: D18.C D19.A
N$21: D18.A Q22.B R109.1 R115.2
N$24: IC21.6(A:BAL/STRB) Q25.C
N$30: Q25.E R122.1
N$31: C66.2 IC21.2(A:+IN) Q21.3(D) R102.2
N$33: C68.2 IC21.3(A:-IN) R108.2 R113.1
N$46: Q24.3(D) R112.1
N$105: IC20.1(A:OUT) IC20.2(B:OUT) R106.1
N$106: IC20.13(D:OUT) IC20.14(C:OUT) R120.1
N$118: Q23.3(D) R107.2
N$153: IC20.5(B:+IN) IC20.6(A:-IN) R101.2
N$161: IC20.8(C:-IN) IC20.11(D:+IN) R121.2
N$170: IC20.7(A:+IN) IC20.9(C:+IN) R105.1 R111.2
N$177: IC20.4(B:-IN) IC20.10(D:-IN) R117.1 R119.2
OUTF+: Q20.A1 R103.2 ; also sheet 6
OVP_FAULT: IC21.1(A:E) Q21.1(G) R109.2 R114.1 ; also sheet 4
PREG_OUT-: R110.1 ; also sheet 2,3
U_MON: R108.1 ; also sheet 2,4
U_SERVO: R101.1 ; also sheet 2
U_SET: R102.1 ; also sheet 4
V+: C63.1 C64.2 C65.2 IC20.3(P:V+) IC21.7(A:C) IC21.8(P:V+) R105.2 ; also sheet 1,2,3,4
V-: C67.2 IC20.12(P:GND) R119.1 ; also sheet 1,2,3
Unconnected: IC21.5(A:BALANCE)

### Notes on the sheet
- Constant Voltage (CV) and Constant Current (CC) mode detection and indication | Over-voltage protection (OVP)
- +0.275 V
- PCB inductor
  ~1.1 uH !
- -2.32 V
- CC/CV mode detection and indication, OVP
- Licensed under the TAPR Open Hardware License (www.tapr.org/OHL)
- More info at http://www.envox.hr/eez
- Repository: https://github.com/eez-open

## Sheet 6 of 6
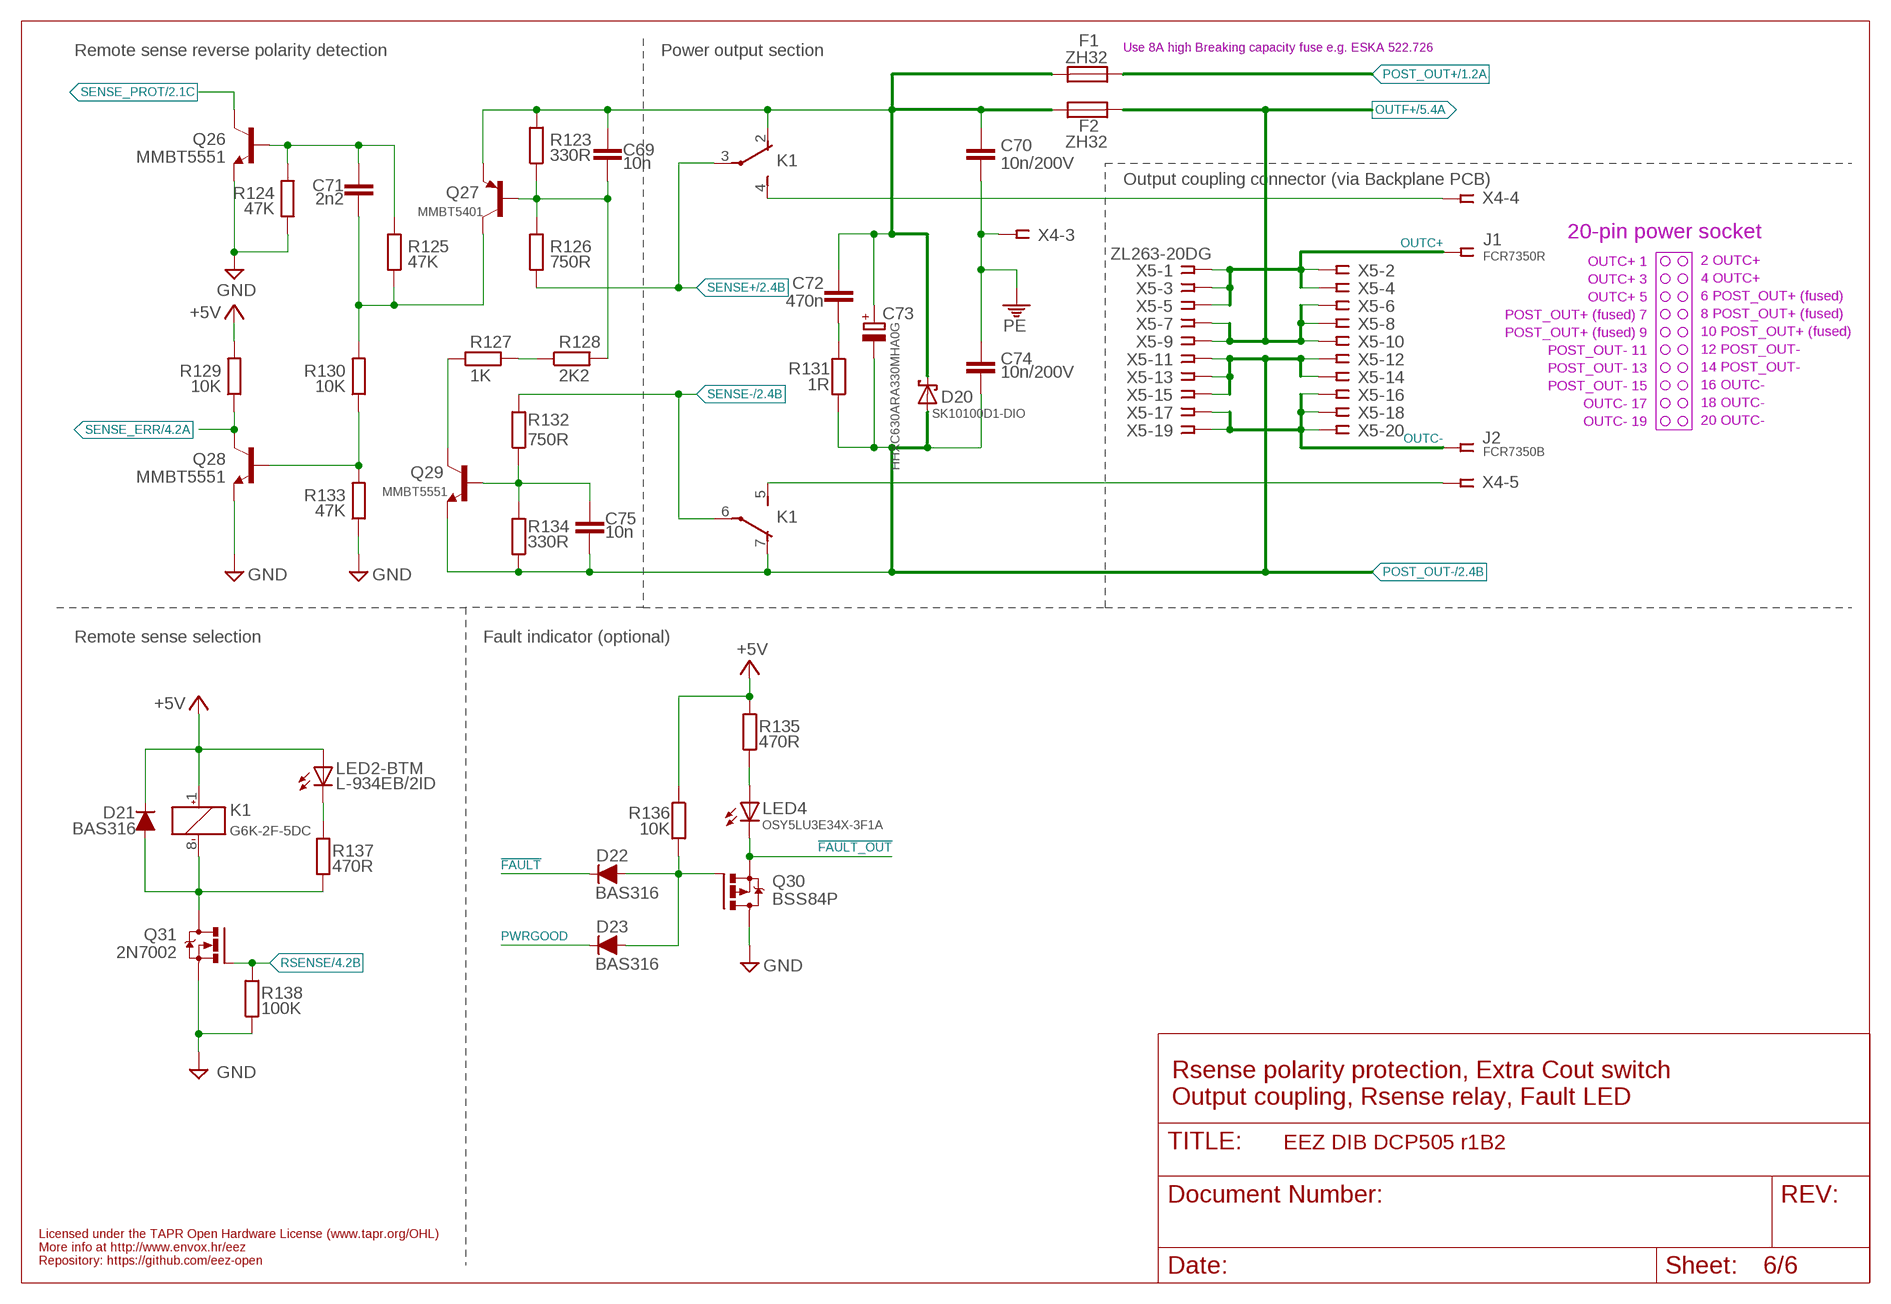
[diagram p5: schematic, sheet 6]

### Parts
C69  10n  C-EUC0805  [C0805]
C70  10n/200V  C-EUC1206  [C1206]
C71  2n2  C-EUC0805  [C0805]
C72  470n  C-EUC1206  [C1206]
C73  HHXC630ARA330MHA0G  ECAPSMD8.3MM/HA0  [CAPAE830X1050N]
C74  10n/200V  C-EUC1206  [C1206]
C75  10n  C-EUC0805  [C0805]
D20  SK10100D1-DIO  SCHOTTKY-DUAL_A_L  [TO252-L]
D21  BAS316  DIODESOD323R  [SOD323-R]
D22  BAS316  DIODESOD323R  [SOD323-R]
D23  BAS316  DIODESOD323R  [SOD323-R]
F1  ZH32  [ZH32]
F2  ZH32  [ZH32]
J1  FCR7350R  BINDING_POSTCLIFF  [S16N-PC]
J2  FCR7350B  BINDING_POSTCLIFF  [S16N-PC]
K1  G6K-2F-5DC  G6K-2F  [G6K-2F]
LED4  OSY5LU3E34X-3F1A  LEDOSG8  [OSG8]
Q26  MMBT5551  MMBT5551LT1-NPN-SOT23-BEC  [SOT23-BEC]
Q27  MMBT5401  BC857B-PNP-SOT23-BEC  [SOT23-BEC]
Q28  MMBT5551  MMBT5551LT1-NPN-SOT23-BEC  [SOT23-BEC]
Q29  MMBT5551  MMBT5551LT1-NPN-SOT23-BEC  [SOT23-BEC]
Q30  BSS84P  IRLML2246TRPBF  [SOT95P237X112-3N]
Q31  2N7002  [SOT103P240X110-3N]
R123  330R  R-EU_R0805  [R0805]
R124  47K  R-EU_R0805  [R0805]
R125  47K  R-EU_R0805  [R0805]
R126  750R  R-EU_R0805  [R0805]
R127  1K  R-EU_R0805  [R0805]
R128  2K2  R-EU_R0805  [R0805]
R129  10K  R-EU_R0805  [R0805]
R130  10K  R-EU_R0805  [R0805]
R131  1R  R-EU_R0805  [R0805]
R132  750R  R-EU_R0805  [R0805]
R133  47K  R-EU_R0805  [R0805]
R134  330R  R-EU_R0805  [R0805]
R135  470R  R-EU_R0805  [R0805]
R136  10K  R-EU_R0805  [R0805]
R137  470R  R-EU_R0805  [R0805]
R138  100K  R-EU_R0805  [R0805]
X5  ZL263-20DG  SSW-110-02-T-D-RA  [SSW-110-02-T-D-RA]

### Nets
!FAULT: D22.C ; also sheet 1
!FAULT_OUT: LED4.C Q30.2(S) ; also sheet 4
+5V: D21.C K1.1(1:+) LED2.BA(-BTM:A) R129.2 R135.2 R136.1 ; also sheet 1,2,4,5
GND: Q26.E Q28.E Q30.3(D) Q31.2(S) R124.1 R133.1 R138.1 ; also sheet 1,2,3,4,5
N$4: C69.1 C70.1 C72.1 C73.+ D20.3(C) F1.2 F2.1 K1.2(2:O) Q27.E R123.2
N$14: D22.A D23.A Q30.1(G) R136.2
N$25: LED4.A R135.1
N$107: C69.2 Q27.B R123.1 R126.2 R128.2
N$108: C71.2 Q27.C R125.1 R130.2
N$109: Q29.C R127.1
N$110: C75.1 Q29.B R132.1 R134.2
N$111: C71.1 Q26.B R124.2 R125.2
N$112: Q28.B R130.1 R133.2
N$113: C72.2 R131.2
N$114: D21.A K1.8(1:-) Q31.3(D) R137.1
N$115: K1.4(2:S) X4.4
N$116: K1.5(3:S) X4.5
N$120: LED2.BC(-BTM:C) R137.2
N$173: R127.2 R128.1
OUTC+: J1.1 J1.NC1 J1.NC2 J1.NC3 J1.NC4 X5.1 X5.2 X5.3 X5.4 X5.5
OUTC-: J2.1 J2.NC1 J2.NC2 J2.NC3 J2.NC4 X5.16 X5.17 X5.18 X5.19 X5.20
OUTF+: F2.2 X5.6 X5.7 X5.8 X5.9 X5.10 ; also sheet 5
PE: C70.2 C74.1 X4.3 ; also sheet 1,2
POST_OUT+: F1.1 ; also sheet 1,2
POST_OUT-: C73.- C74.2 C75.2 D20.1(A) D20.2(A) K1.7(3:O) Q29.E R131.1 R134.1 X5.11 X5.12 X5.13 X5.14 X5.15 ; also sheet 2,3
PWRGOOD: D23.C ; also sheet 1,4
RSENSE: Q31.1(G) R138.2 ; also sheet 4
SENSE+: K1.3(2:P) R126.1 ; also sheet 2
SENSE-: K1.6(3:P) R132.2 ; also sheet 2
SENSE_ERR: Q28.C R129.1 ; also sheet 4
SENSE_PROT: Q26.C ; also sheet 2

### Notes on the sheet
- Use 8A high Breaking capacity fuse e.g. ESKA 522.726
- Remote sense reverse polarity detection | Power output section
- Output coupling connector (via Backplane PCB)
- 20-pin power socket
- OUTC+ 1
- 2 OUTC+
- OUTC+ 3
- 4 OUTC+
- OUTC+ 5
- 6 POST_OUT+ (fused)
- POST_OUT+ (fused) 7
- 8 POST_OUT+ (fused)
- POST_OUT+ (fused) 9
- 10 POST_OUT+ (fused)
- POST_OUT- 11
- 12 POST_OUT-
- POST_OUT- 13
- 14 POST_OUT-
- POST_OUT- 15
- 16 OUTC-
- OUTC- 17
- 18 OUTC-
- OUTC- 19
- 20 OUTC-
- Remote sense selection | Fault indicator (optional)
- Rsense polarity protection, Extra Cout switch
- Output coupling, Rsense relay, Fault LED
- Licensed under the TAPR Open Hardware License (www.tapr.org/OHL)
- More info at http://www.envox.hr/eez
- Repository: https://github.com/eez-open

## Library data of the parts
C1-C4 C6-C49 C51-C72 C74 C75 = rcl:C-EU: CAPACITOR, European symbol
C5 C50 C73 = EEZ_Lib1:ECAP
D1-D4 = diode:DIODE-: DIODE
D5-D14 D16-D19 D21-D23 = EEZ_Lib1:DIODE
D15 D20 = EEZ_Lib1:SCHOTTKY
F1 F2 = EEZ_Lib1:ZH32: Fuse holder with cover; tube fuses; 5x20mm
FB1-FB5 FB8 = EEZ_inductors_and_transformers:FERRITE_BEAD: FAIR-RITE - 2506033007Y3 - FERRITE BEAD, 0.04OHM, 3A, 0603 Farnell: 2112873
FB6 FB7 = rcl:L-EU: INDUCTOR, European symbol
FM1 FM2 = EEZ_Lib1:FIDUCIAL: Fiducial mark for pick and place automation
IC1 = EEZ_Lib1:LP2951: LP2950-N/LP2951-N Series of Adjustable Micropower Voltage Regulators
IC2 IC5 = EEZ_Lib1:SI8641: Low power 4-ch digital isolator (3+1) Farnell: 2423288
IC3 = EEZ_DIB:SN74LVC1G139: 2-to-4 Line Decoder
IC4 = EEZ_Lib1:MC79LXX: 3-terminal negative voltage regulator, up to 100mA
IC6 = EEZ_Lib1:AT24CXX: I2C-Compatible (2-wire) Serial EEPROM
IC7 = EEZ_Lib1:TMPX75: Temperature Sensor With I2C and SMBus Interface
IC8 IC9 IC11 = EEZ_Lib1:TL072
IC10 IC12 = EEZ_Lib1:TL074: LOW-NOISE JFET-INPUT OPERATIONAL AMPLIFIERS; MPN: TL074ACD; OC_FARNELL: 9593349; OC_NEWARK: 52F2748; PACKAGE: SOIC-14; SUPPLIER: Texas Instruments
IC13 = EEZ_Lib1:74HC4066: Quad bilateral ANALOG SWITCH
IC14 = EEZ_Lib1:SN74LVC1G74DCTR: Single Positive-Edge-Triggered D-Type Flip-Flop with Clear and Preset
IC15 = EEZ_Lib1:MCP23S17-E/SS: 16-Bit I/O Expander with Serial Interface; FARNELL: 1467675; TME: MCP23S17-E/SS
IC16 = EEZ_Lib1:REF50XX: Low-Noise (3μVpp/V), Very Low Drift (max. 8ppm/°C), Precision Voltage Reference Pin compatible with REF2 Farnell: 1439628
IC17 = EEZ_Lib1:DAC8552_DGK_8
IC18 = EEZ_Lib1:SN74LVC1G3157
IC19 = EEZ_Lib1:ADS1120: Low-Power, Low-Noise, 16-Bit, Analog-to-Digital Converter for Small-Signal Sensors Farnell: 2402249
IC20 = EEZ_Lib1:LM339: Low Power Low Offset Voltage Quad Comparators with open collector; LM139/LM239/LM339/LM2901/LM3302
IC21 = EEZ_Lib1:LM211: Differential Comparator, 165 ns
J1 J2 = EEZ_Lib1:BINDING_POST: Various 4 mm binding posts
JP1 JP2 JP4 = EEZ_Lib1:JP3-CUT
JP3 = EEZ_Lib1:JP2-CUT
K1 = relay:G6K: Low Signal Relay oeiwcsnts1.omron.com/.. D20G6K0100.pdf; MF: OMRON COMPONENTS USA; MPN: G6K-2F DC24; OC_FARNELL: 1690427; OC_NEWARK: 36K7467
KK1 KK2 = EEZ_Lib1:PCB-MB: Richo Mounting Block; 16 x 6 mm
LED1 = EEZ_Lib1:LED_L-42WUM/1EGWT: 3 mm right angle bicolor LED indicator
LED2 LED3 = EEZ_Lib1:LED_L-934EB: Kingbright Electronic LED x 2; in housing; 3mm; 20mA; Lens: diffused
LED4 = EEZ_Lib1:LED
Q1 = EEZ_Lib1:IRFP240: N-channel MOSFET (TO-247)
Q2 Q4 Q6 = EEZ_Lib1:BCP56: Low power NPN Transistor, Vceo=80V, Ic=1A, SOT-223
Q3 Q7 Q8 Q16 Q17 Q27 = transistor:*-PNP-: PNP Transistror
Q5 = EEZ_Lib1:P-MOSFET: HEXFET Power MosFet Source: http://www.irf.com/
Q9 Q10 Q22 Q25 Q26 Q28 Q29 = transistor:*-NPN-: NPN Transistror BF959 corrected 2008.03.06
Q11-Q13 = EEZ_Lib1:N-MOSFET
Q14 Q15 Q18 Q21 Q23 Q24 Q31 = EEZ_Lib1:2N7002: N-CHANNEL ENHANCEMENT MODE FIELD EFFECT TRANSISTOR; MPN: 2N7002-7-F; OC_FARNELL: 1713823; OC_NEWARK: 25R5679; PACKAGE: SOT-23-3; SUPPLIER: DIODES INC.
Q19 Q30 = EEZ_Lib1:IRLML2246TRPBF: HEXFET Power MOSFET (-20V, -2.6A); MPN: IRLML2246TRPBF; OC_FARNELL: 1888166; OC_NEWARK: 40T7450; PACKAGE: SOT-3; SUPPLIER: International Rectifier; TME: IRLML2246TRPBF
Q20 = EEZ_Lib1:BTA41: Triac; 40A; 50mA; THT; TOP3
R1-R62 R64-R72 R74-R138 = rcl:R-EU_: RESISTOR, European symbol
R63 R73 = EEZ_Lib1:R-EU_4WIRE
RN1 RN2 = EEZ_Lib1:R_ARRAY4: 1206 four resistor array
SH1 SH2 = EEZ_Lib1:SHORT
X1 = EEZ_connectors:SSW-113-02-T-D-RA: Samtec SSW-113-02-T-D-RA Receptacle, 2.54MM, RA, 26-way; FARNELL: 1805583; TME: ZL263-26DG
X2 = EEZ_connectors:SPOX_22-05-7095: Molex socket; wire-board; male; SPOX; 2.5mm; PIN:9; THT; 3A; tinned; 250V
X3 = EEZ_connectors:MINIFIT_6659-3: MOLEX 39303035 Wire-To-Board Connector, Single In Line, Mini-Fit Jr 5569 Series, 3 Contacts, Plug, 4.2 mm; FARNELL: 9963545
X4 = EEZ_connectors:MC1,5/5-G-3,5: Pluggable Terminal Blocks 5-pin 3.5mm pitch Through Hole Header
X5 = EEZ_connectors:SSW-110-02-T-D-RA: Samtec SSW-113-02-T-D-RA Receptacle, 2.54MM, RA, 20-way
ZD1 ZD2 = EEZ_Lib1:ZENER-DIODE
ZD3 = EEZ_Lib1:SLVU2.8: 2.8Volts ESD Protection Devices

## Net classes
0 default: width 0.203 mm, drill 0.3 mm, clearance 0.203 mm
1 lvds: width 0.152 mm, drill 0.3 mm, clearance 0.152 mm to class 0, clearance 0.152 mm
2 gnd: width 0.254 mm, drill 0.584 mm, clearance 0.254 mm